# EAGLE design nRF24L01HBridge (EAGLE 6.4)
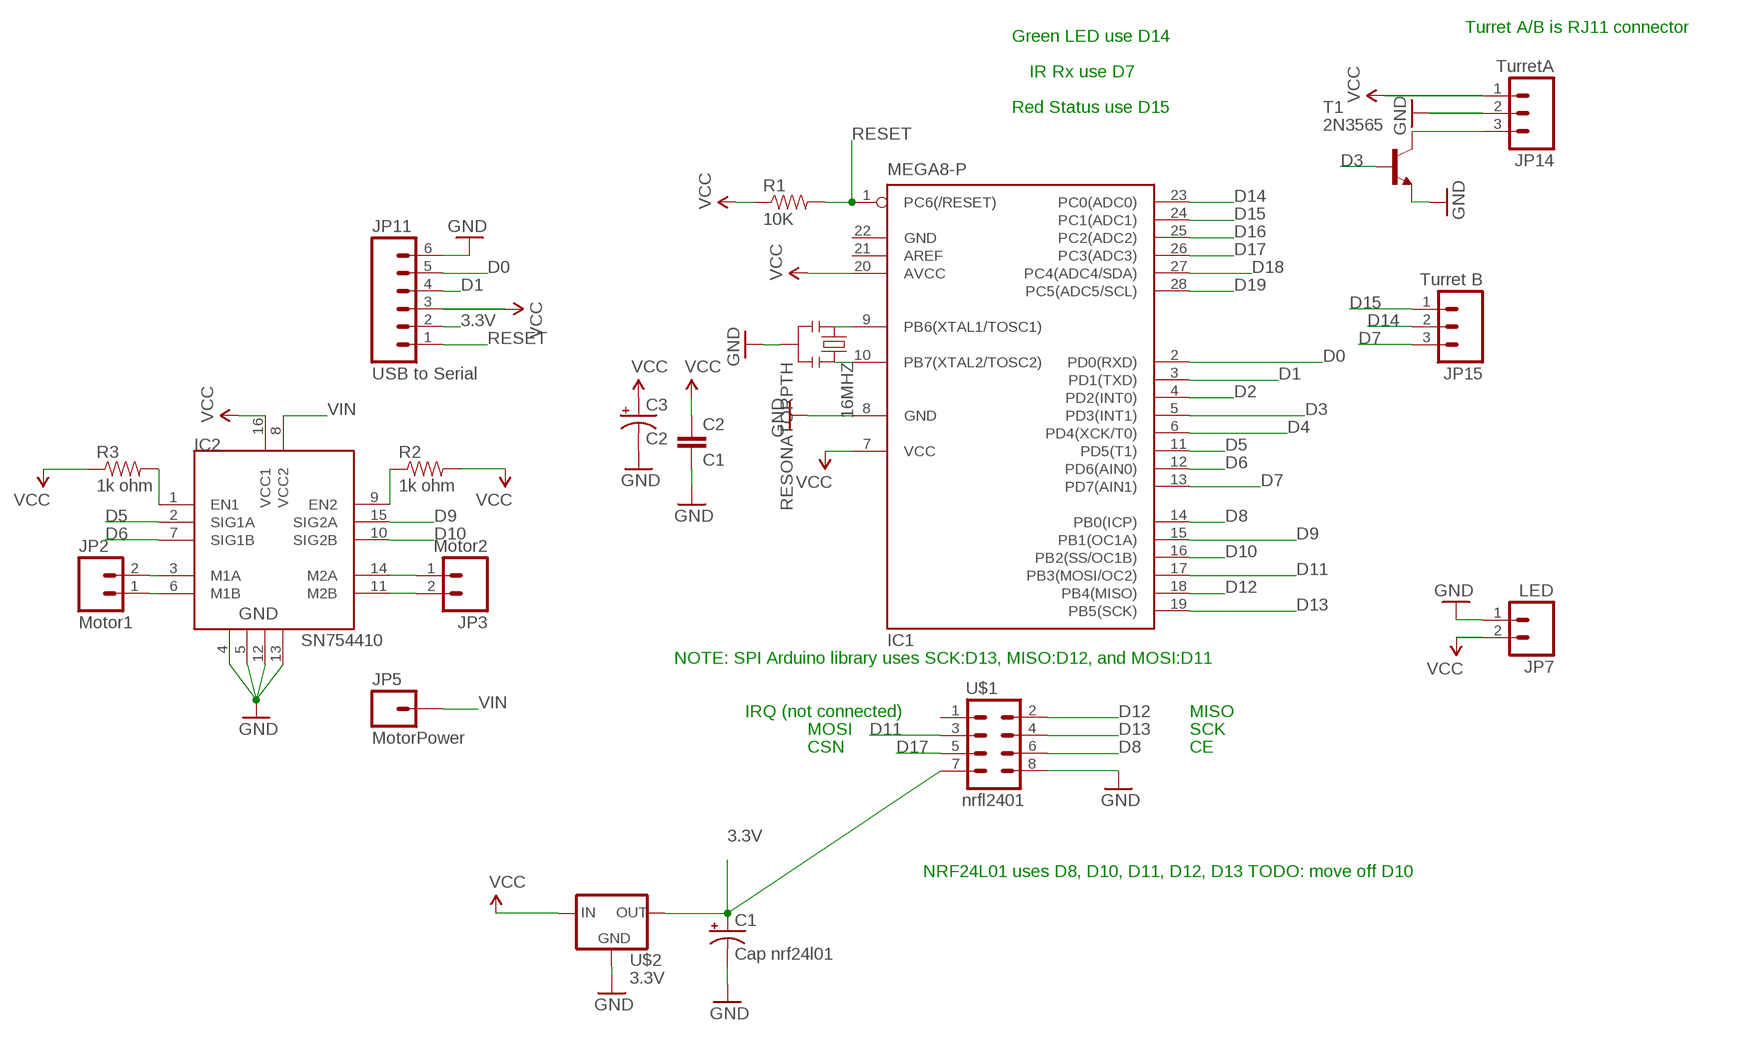
[diagram p0: schematic, sheet 1]

## Parts
16MHZ  RESONATORPTH  [RESONATOR-PTH]
C1  Cap nrf24l01  CAP_POLPTH2  [CPOL-RADIAL-10UF-25V]
C2  C1  CAPPTH  [CAP-PTH-SMALL]
C3  C2  CAP_POLPTH1  [CPOL-RADIAL-100UF-25V]
IC1  MEGA8-P  [DIL28-3]
IC2  SN754410  [DIP16]
JP2  Motor1  M02LOCK  [1X02_LOCK]
JP3  Motor2  M02LOCK  [1X02_LOCK]
JP5  MotorPower  M01PTH  [1X01]
JP7  LED  M02PTH  [1X02]
JP11  USB to Serial  M06SIP  [1X06]
JP14  TurretA  M03PTH  [1X03]
JP15  Turret B  M03PTH  [1X03]
R1  10K  RESISTORPTH1  [AXIAL-0.3]
R2  1k ohm  RESISTORPTH1  [AXIAL-0.3]
R3  1k ohm  RESISTORPTH1  [AXIAL-0.3]
T1  2N3565  [TO92]
U$1  nrfl2401  M04X2  [2X4]
U$2  3.3V  V_REG_LD1117VXX  [78XXL]

## Nets
3.3V: C1.1(+) JP11.2 U$1.7 U$2.GND(OUT)
D0: IC1.2(PD0(RXD)) JP11.5
D1: IC1.3(PD1(TXD)) JP11.4
D2: IC1.4(PD2(INT0))
D3: IC1.5(PD3(INT1)) T1.2(B)
D4: IC1.6(PD4(XCK/T0))
D5: IC1.11(PD5(T1)) IC2.2(SIG1A)
D6: IC1.12(PD6(AIN0)) IC2.7(SIG1B)
D7: IC1.13(PD7(AIN1)) JP15.3
D8: IC1.14(PB0(ICP)) U$1.6
D9: IC1.15(PB1(OC1A)) IC2.15(SIG2A)
D10: IC1.16(PB2(SS/OC1B)) IC2.10(SIG2B)
D11: IC1.17(PB3(MOSI/OC2)) U$1.3
D12: IC1.18(PB4(MISO)) U$1.2
D13: IC1.19(PB5(SCK)) U$1.4
D14: IC1.23(PC0(ADC0)) JP15.2
D15: IC1.24(PC1(ADC1)) JP15.1
D16: IC1.25(PC2(ADC2))
D17: IC1.26(PC3(ADC3)) U$1.5
D18: IC1.27(PC4(ADC4/SDA))
D19: IC1.28(PC5(ADC5/SCL))
GND: 16MHZ.2 C1.2(-) C2.2 C3.2(-) IC1.8(GND) IC2.4 IC2.5 IC2.12 IC2.13 JP7.1 JP11.6 JP14.2 T1.3(E) U$1.8 U$2.IN(GND)
N$1: 16MHZ.3 IC1.10(PB7(XTAL2/TOSC2))
N$2: 16MHZ.1 IC1.9(PB6(XTAL1/TOSC1))
N$3: IC2.9(EN2) R2.P$1
N$4: IC2.1(EN1) R3.P$2
N$5: IC2.6(M1B) JP2.1
N$6: IC2.3(M1A) JP2.2
N$7: IC2.14(M2A) JP3.1
N$8: IC2.11(M2B) JP3.2
N$9: JP14.3 T1.1(C)
RESET: IC1.1(PC6(/RESET)) JP11.1 R1.P$2
VCC: C2.1 C3.1(+) IC1.7(VCC) IC1.20(AVCC) IC2.16(VCC1) JP7.2 JP11.3 JP14.1 R1.P$1 R2.P$2 R3.P$1 U$2.OUT(IN)
VIN: IC2.8(VCC2) JP5.1
Unconnected: IC1.21(AREF) U$1.1

## Notes on the sheet
- Turret A/B is RJ11 connector
- Green LED use D14
- IR Rx use D7
- Red Status use D15
- NOTE: SPI Arduino library uses SCK:D13, MISO:D12, and MOSI:D11
- IRQ (not connected) | MISO
- MOSI | SCK
- CSN | CE
- NRF24L01 uses D8, D10, D11, D12, D13 TODO: move off D10

## Power pins joined to a net without a drawn wire
GND: IC1.22(GND)

## Library data of the parts
16MHZ = SparkFun:RESONATOR: Resonator Small SMD resonator. This is the itty bitty 10/20MHz resonators with built in caps. CSTCE10M0G55 and CSTCE20M0V53. Footprint has been reviewed closely but hasn't been tested yet.
C1 C3 = SparkFun:CAP_POL: Capacitor Polarized These are standard SMD and PTH capacitors. Normally 10uF, 47uF, and 100uF in electrolytic and tantalum varieties. Always verify the external diameter of the through hole cap, it varies with capacity, voltage, and manufacturer. The EIA devices should be standard.
C2 = SparkFun:CAP: Capacitor Standard 0603 ceramic capacitor, and 0.1" leaded capacitor.
IC1 = atmel:MEGA8-P: MICROCONTROLLER 8 Kbytes FLASH, 1 kbytes SRAM, 512 bytes EEPROM, USART, 4-channel 10 bit ADC, 2-channel 8 bit ADC Pin compatible with Atmega48, ATMega88, ATMega168 Source: avr.lbr; OC_FARNELL: unknown; OC_NEWARK: unknown
IC2 = HBridge:SN754410: Quadruple half-H driver
JP2 JP3 = SparkFun-Connectors:M02: Header 2 Standard 2-pin 0.1" header. Use with straight break away headers (SKU : PRT-00116), right angle break away headers (PRT-00553), swiss pins (PRT-00743), machine pins (PRT-00117), and female headers (PRT-00115). Molex polarized connector foot print use with SKU : PRT-08233 with associated crimp pins and housings.
JP5 = SparkFun-Connectors:M01: Header 1 Standard 1-pin 0.1" header. Use with straight break away headers (SKU : PRT-00116), right angle break away headers (PRT-00553), swiss pins (PRT-00743), machine pins (PRT-00117), and female headers (PRT-00115).
JP7 = SparkFun:M02: Header 2 Standard 2-pin 0.1" header. Use with straight break away headers (SKU : PRT-00116), right angle break away headers (PRT-00553), swiss pins (PRT-00743), machine pins (PRT-00117), and female headers (PRT-00115). Molex polarized connector foot print use with SKU : PRT-08233 with associated crimp pins and housings.
JP11 = SparkFun:M06: Header 6 Standard 6-pin 0.1" header. Use with straight break away headers (SKU : PRT-00116), right angle break away headers (PRT-00553), swiss pins (PRT-00743), machine pins (PRT-00117), and female headers (PRT-00115). Molex polarized connector foot print use with SKU : PRT-08094 with associated crimp pins and housings. NOTES ON THE VARIANTS LOCK and LOCK_LONGPADS... This footprint was designed to help hold the alignment of a through-hole component (i.e. 6-pin header) while soldering it into place. You may notice that each hole has been shifted either up or down by 0.005 of an inch from it's more standard position (which is a perfectly straight line). This slight alteration caused the pins (the squares in the middle) to touch the edges of the holes. Because they are alternating, it causes a "brace" to hold the component in place. 0.005 has proven to be the perfect amount of "off-center" position when using our standard breakaway headers. Although looks a little odd when you look at the bare footprint, once you have a header in there, the alteration is very hard to notice. Also, if you push a header all the way into place, it is covered up entirely on the bottom side. This idea of altering the position of holes to aid alignment will be further integrated into the Sparkfun Library for other footprints. It can help hold any component with 3 or more connection pins.
JP14 JP15 = SparkFun:M03: Header 3 Standard 3-pin 0.1" header. Use with straight break away headers (SKU : PRT-00116), right angle break away headers (PRT-00553), swiss pins (PRT-00743), machine pins (PRT-00117), and female headers (PRT-00115). Molex polarized connector foot print use with SKU : PRT-08232 with associated crimp pins and housings.
R1-R3 = SparkFun:RESISTOR: Resistor Basic schematic elements and footprints for 0603, 1206, and PTH 1/10th watt (small) resistors.
T1 = transistor-neu-to92:2N3565: NPN TRANSISTOR
U$1 = SparkFun:M04X2
U$2 = SparkFun:V_REG_LD1117VXX: LD1117VXX voltage regulator. We carry the 3.3V version (COM-00526) in TO-220 package.

## Board
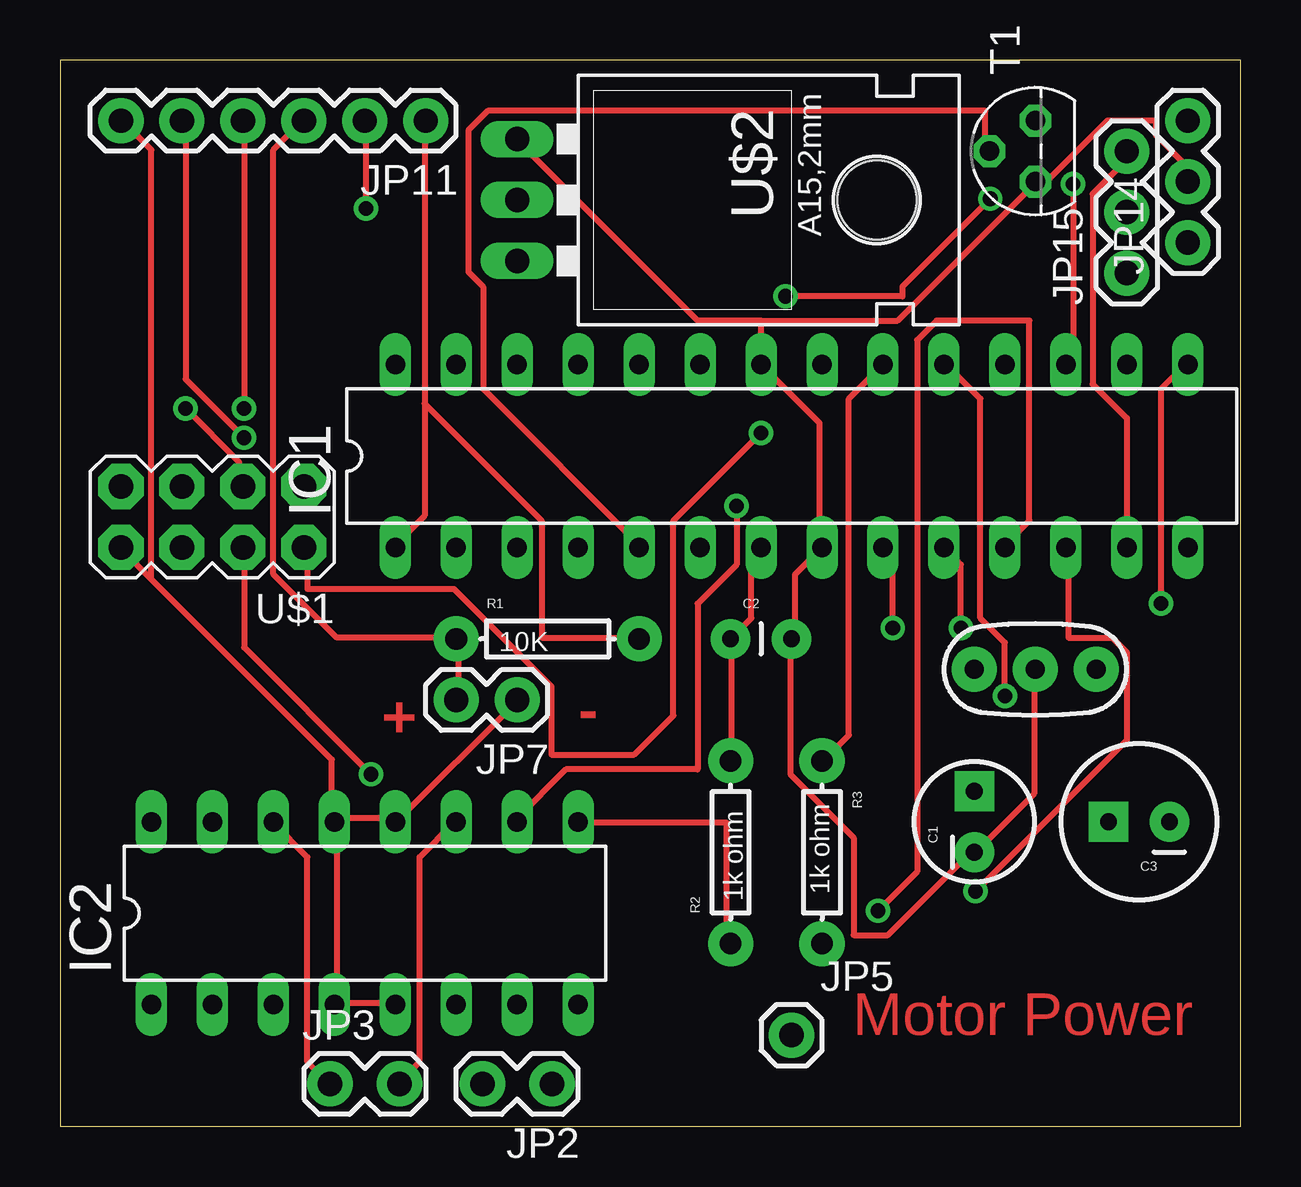
[diagram p1: board, top side]
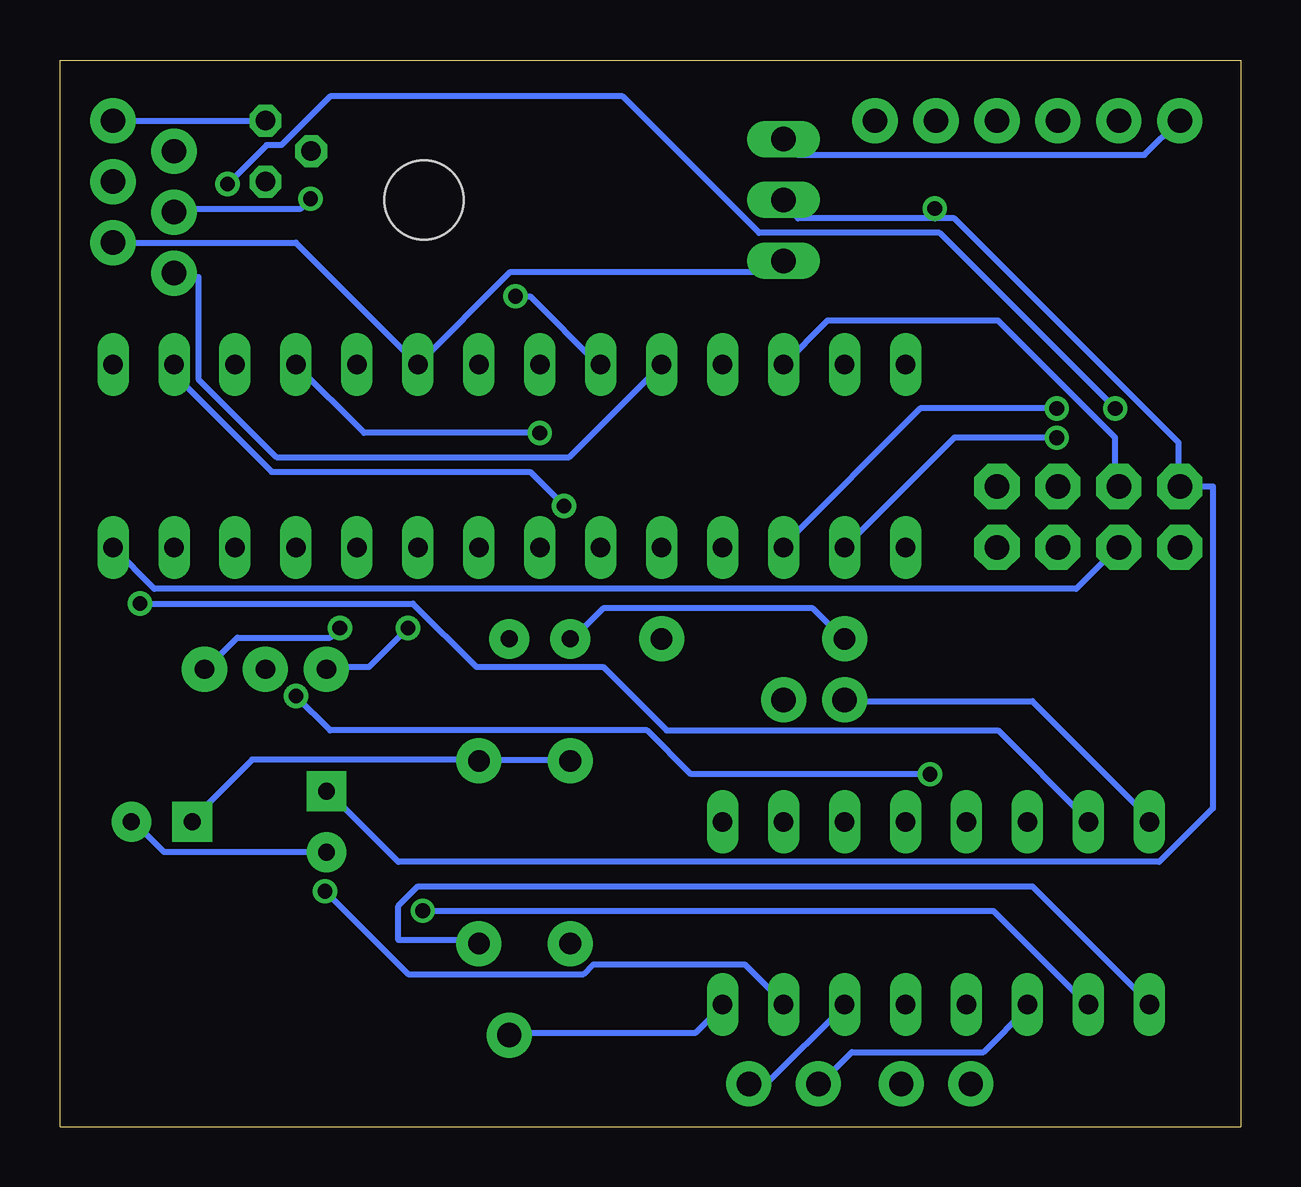
[diagram p2: board, bottom side, seen from below]

Size 49.2 x 44.45 mm. Coordinates in mm from the lower left corner, seen from the top.
Outline: 49.2,0 49.2,44.45 0,44.45 0,0 49.2,0
Copper layers (1*16): Top 0.035mm / dielectric 1.5mm / Bottom 0.035mm
Design rules "default": minimum track width 10mil, minimum drill 24mil, track to track 8mil, track to pad 8mil, pad to pad 8mil, via to via 8mil, smd to smd 8mil, copper to edge 40mil, drill to drill 8mil, minimum pad ring 10mil, minimum via ring 8mil, stop-mask expansion 4mil, vias tented up to drill 0mil, thermal gap 10mil

### Footprints (pad centres in the part's own frame; a part is rotated, then mirrored left to right if it is on the bottom)
RESONATOR-PTH = drill 0.8 pad 1.88: 1 -2.54,0; 2 0,0; 3 2.54,0
CPOL-RADIAL-10UF-25V = drill 0.7 pad 1.651 square: 1 1.27,0 | drill 0.7 pad 1.651: 2 -1.27,0
CAP-PTH-SMALL = drill 0.7 pad 1.651: 1 0,0; 2 2.54,0
CPOL-RADIAL-100UF-25V = drill 0.7 pad 1.651 square: 1 1.27,0 | drill 0.7 pad 1.651: 2 -1.27,0
DIL28-3 = drill 0.813 long: 1 -16.51,-3.81; 2 -13.97,-3.81; 3 -11.43,-3.81; 4 -8.89,-3.81; 5 -6.35,-3.81; 6 -3.81,-3.81; 7 -1.27,-3.81; 8 1.27,-3.81; 9 3.81,-3.81; 10 6.35,-3.81; 11 8.89,-3.81; 12 11.43,-3.81; 13 13.97,-3.81; 14 16.51,-3.81; 15 16.51,3.81; 16 13.97,3.81; 17 11.43,3.81; 18 8.89,3.81; 19 6.35,3.81; 20 3.81,3.81; 21 1.27,3.81; 22 -1.27,3.81; 23 -3.81,3.81; 24 -6.35,3.81; 25 -8.89,3.81; 26 -11.43,3.81; 27 -13.97,3.81; 28 -16.51,3.81
DIP16 = drill 0.813 long: 1 -10.16,-3.81; 2 -7.62,-3.81; 3 -5.08,-3.81; 4 -2.54,-3.81; 5 0,-3.81; 6 2.54,-3.81; 7 5.08,-3.81; 8 7.62,-3.81; 9 7.62,3.81; 10 5.08,3.81; 11 2.54,3.81; 12 0,3.81; 13 -2.54,3.81; 14 -5.08,3.81; 15 -7.62,3.81; 16 -10.16,3.81
1X02_LOCK = drill 1.016 pad 1.88: 1 -0.178,0; 2 2.718,0
1X01 = drill 1.016 pad 1.88: 1 0,0
1X02 = drill 1.016 pad 1.88: 1 0,0; 2 2.54,0
1X06 = drill 1.016 pad 1.88: 1 0,0; 2 2.54,0; 3 5.08,0; 4 7.62,0; 5 10.16,0; 6 12.7,0
1X03 = drill 1.016 pad 1.88: 1 0,0; 2 2.54,0; 3 5.08,0
AXIAL-0.3 = drill 0.9 pad 1.88: P$1 -3.81,0; P$2 3.81,0
TO92 = drill 0.813 octagon: 1 1.27,0; 2 0,1.905; 3 -1.27,0
2X4 = drill 1.016 pad 1.88 octagon: 1 -3.81,-1.27; 2 -3.81,1.27; 3 -1.27,-1.27; 4 -1.27,1.27; 5 1.27,-1.27; 6 1.27,1.27; 7 3.81,-1.27; 8 3.81,1.27
78XXL = drill 1.016 long: GND 0,-3.81; IN -2.54,-3.81; OUT 2.54,-3.81 | hole 3.302: 0,11.176

### Placement (x,y rotation side)
16MHZ  40.64,19.06 0 top
C1  38.1,12.71 90 top
C2  27.94,20.33 0 top
C3  44.96,12.71 180 top
IC1  30.48,27.95 0 top
IC2  13.97,8.9 0 top
JP2  20.32,1.79 180 top
JP3  11.43,1.79 0 top
JP5  30.48,3.82 0 top
JP7  19.05,17.79 180 top
JP11  15.24,41.92 180 top
JP14  46.99,36.84 90 top
JP15  44.45,35.57 90 top
R1  20.32,20.33 0 top
R2  27.94,11.44 90 top
R3  31.75,11.44 270 top
T1  40.64,40.65 90 top
U$1  6.35,25.41 180 top
U$2  22.86,38.62 270 top

### Tracks (layer width: path | path; a pad name or v marks a point on that pad's centre or on a via)
3.3V  (via drill 0.61)
  Top 0.254: v12.75,38.26 12.75,41.92 JP11.2
  Bottom 0.254: 12.75,37.86 11.94,37.86 2.59,28.51 2.59,26.68 U$1.7 1.17,26.68 1.17,13.27 3.4,11.03 35.1,11.03 37.95,13.88 C1.1 | 12.75,37.86 18.44,37.86 19.05,38.47 U$2.GND | 12.75,37.86 v12.75,38.26
D0  (via drill 0.61)
  Top 0.254: v7.67,28.71 5.23,31.15 5.23,41.92 JP11.5
  Bottom 0.254: IC1.2 11.94,28.71 v7.67,28.71
D1  (via drill 0.61)
  Top 0.254: v7.67,29.93 7.67,41.92 JP11.4
  Bottom 0.254: v7.67,29.93 13.36,29.93 19.05,24.24 IC1.3
D3
  Top 0.254: IC1.5 24.13,24.24 17.63,30.74 17.63,35.01 17.02,35.62 17.02,41.51 17.83,42.33 38.56,42.33 38.56,40.7 T1.2
D5  (via drill 0.61)
  Top 0.254: v34.09,9 35.71,10.63 35.71,32.78 36.52,33.59 40.39,33.59 40.39,25.26 39.37,24.24 IC1.11
  Bottom 0.254: v34.09,9 10.31,9 6.45,5.14 IC2.2
D6  (via drill 0.61)
  Top 0.254: v38.15,9.81 44.45,16.11 44.45,19.77 43.84,20.38 42.01,20.38 42.01,24.04 IC1.12
  Bottom 0.254: v38.15,9.81 34.7,6.36 27.38,6.36 26.98,6.77 20.68,6.77 19.05,5.14 IC2.7
D7
  Top 0.254: IC1.13 44.45,29.53 43.03,30.95 43.03,38.87 44.45,40.29 JP15.3
D8
  Bottom 0.254: IC1.14 45.26,22.41 6.86,22.41 5.23,24.04 U$1.6
D9  (via drill 0.61)
  Top 0.254: v45.87,21.8 45.87,30.74 46.89,31.76 IC1.15
  Bottom 0.254: v45.87,21.8 34.49,21.8 31.85,19.16 26.57,19.16 23.93,16.52 10.11,16.52 6.45,12.86 IC2.15
D10  (via drill 0.61)
  Top 0.254: v28.19,25.87 28.19,23.43 26.57,21.8 26.57,14.89 21.08,14.89 19.05,12.86 IC2.10
  Bottom 0.254: v28.19,25.87 29.62,27.29 40.39,27.29 44.45,31.35 IC1.16
D11  (via drill 0.61)
  Top 0.254: v42.22,39.28 42.22,31.96 42.01,31.76 IC1.17 | v5.23,29.93 7.47,27.7 7.47,26.68 U$1.3
  Bottom 0.254: v42.22,39.28 40.59,40.9 39.98,40.9 37.95,42.94 25.76,42.94 20.07,37.25 12.55,37.25 v5.23,29.93
D12  (via drill 0.61)
  Top 0.254: v29.21,28.92 25.55,25.26 25.55,17.13 23.93,15.5 20.47,15.5 20.47,18.35 16.41,22.41 10.31,22.41 10.31,24.04 U$1.2
  Bottom 0.254: IC1.18 36.52,28.92 v29.21,28.92
D13  (via drill 0.61)
  Top 0.254: v39.37,17.94 39.37,20.18 38.35,21.19 38.35,30.34 36.93,31.76 IC1.19 | v12.95,14.69 7.67,19.97 7.67,24.04 U$1.4
  Bottom 0.254: v39.37,17.94 37.95,16.52 24.74,16.52 22.91,14.69 v12.95,14.69
D14  (via drill 0.61)
  Top 0.254: v30.23,34.61 35.1,34.61 35.1,35.01 v38.76,38.67
  Bottom 0.254: v30.23,34.61 29.62,34.61 26.77,31.76 IC1.23 | v38.76,38.67 39.17,38.26 44.45,38.26 JP15.2
D15
  Bottom 0.254: IC1.24 27.99,27.9 40.18,27.9 43.43,31.15 43.43,35.42 44.45,35.42 JP15.1
D17
  Bottom 0.254: IC1.26 17.22,33.59 10.11,33.59 5.23,28.71 5.23,26.68 U$1.5
GND
  Top 0.254: 11.53,5.14 13.97,5.14 IC2.5 | IC2.13 11.53,12.86 13.97,12.86 IC2.12 13.97,12.66 19.05,17.74 JP7.1 | 11.53,5.14 11.53,12.66 IC2.13 | 11.53,5.14 IC2.4 | 3.81,22.82 11.33,15.3 11.33,12.86 IC2.13 | 3.81,22.82 2.59,24.04 U$1.8 | 3.81,22.82 3.81,40.7 2.59,41.92 JP11.6 | 16MHZ.2 40.59,18.96 40.59,13.88 38.15,11.44 C1.2 37.95,11.44 34.49,7.99 33.07,7.99 33.07,12.05 30.43,14.69 30.43,20.18 C2.2 30.63,20.38 30.63,23.02 IC1.8 31.65,24.24 31.65,29.32 IC1.22 29.21,33.59 | JP14.2 46.89,39.48 46.89,40.09 45.67,41.31 45.67,41.92 43.64,41.92 41.2,39.48 40.79,39.48 T1.3 40.59,39.28 34.9,33.59 29.21,33.59 | 29.21,33.59 26.57,33.59 19.05,41.11 U$2.IN
  Bottom 0.254: C1.2 44.86,11.44 46.08,12.66 C3.2 | JP11.6 2.59,41.92 4.01,40.5 18.44,40.5 19.05,41.11 U$2.IN
N$1  (via drill 0.61)
  Top 0.254: IC1.10 37.54,23.43 v37.54,20.79
  Bottom 0.254: v37.54,20.79 37.95,20.38 41.81,20.38 43.03,19.16 16MHZ.3
N$2  (via drill 0.61)
  Top 0.254: v34.7,20.79 34.7,23.63 34.29,24.04 IC1.9
  Bottom 0.254: v34.7,20.79 36.32,19.16 37.95,19.16 16MHZ.1
N$3
  Top 0.254: IC2.9 21.69,12.66 27.79,12.66 27.79,7.78 R2.P$1
N$4
  Bottom 0.254: IC2.1 3.81,5.14 8.69,10.02 34.29,10.02 35.1,9.21 35.1,7.78 31.85,7.78 R3.P$2
N$5
  Bottom 0.254: IC2.6 16.61,4.94 19.66,1.89 20.47,1.89 JP2.1
N$6
  Bottom 0.254: IC2.3 8.89,4.94 10.72,3.11 16.2,3.11 17.42,1.89 JP2.2
N$7
  Top 0.254: IC2.14 8.89,12.66 10.31,11.24 10.31,2.7 11.12,1.89 JP3.1
N$8
  Top 0.254: IC2.11 16.41,12.66 14.99,11.24 14.99,2.7 14.17,1.89 JP3.2
N$9
  Bottom 0.254: JP14.3 T1.1
RESET
  Top 0.254: 15.19,30.13 15.19,41.92 JP11.1 | 15.19,30.13 15.19,25.46 13.97,24.24 IC1.1 | 15.19,30.13 20.07,25.26 20.07,20.38 24.13,20.38 R1.P$2
VCC
  Top 0.254: IC1.7 29.21,24.04 28.8,23.63 28.8,21.19 C2.1 27.99,20.18 27.99,15.3 R2.P$2 | JP7.2 16.61,17.94 16.61,20.18 R1.P$1 16.41,20.38 11.53,20.38 8.89,23.02 8.89,40.7 10.11,41.92 JP11.3 | IC1.20 32.87,30.34 32.87,16.32 31.85,15.3 R3.P$1
  Bottom 0.254: JP14.1 39.37,36.84 IC1.20 30.43,35.62 19.46,35.62 19.05,36.03 U$2.OUT | C3.1 43.64,12.86 41.2,15.3 31.85,15.3 R3.P$1 31.65,15.3 27.99,15.3 R2.P$2 | IC2.16 3.81,12.86 8.69,17.74 16.41,17.74 JP7.2 | C2.1 27.79,20.38 26.57,21.6 17.83,21.6 16.61,20.38 R1.P$1
VIN
  Bottom 0.254: IC2.8 21.69,4.94 22.71,3.92 30.43,3.92 JP5.1

### Text on the board
Top: + | - | Motor Power